# EasyEDA Pro project ProPrj_Practice 4 layer_2025-08-23.epro, schematic Schematic2
Board Name: 8 Digital Inputs; Create Date: 2025-08-18; Page Name: P1; Project Name: Practice 4 layer; Schematic Name: Schematic2; Update Date: 2025-08-18; Company: EasyEDA.com; Page Size: A4; Version: V1.0
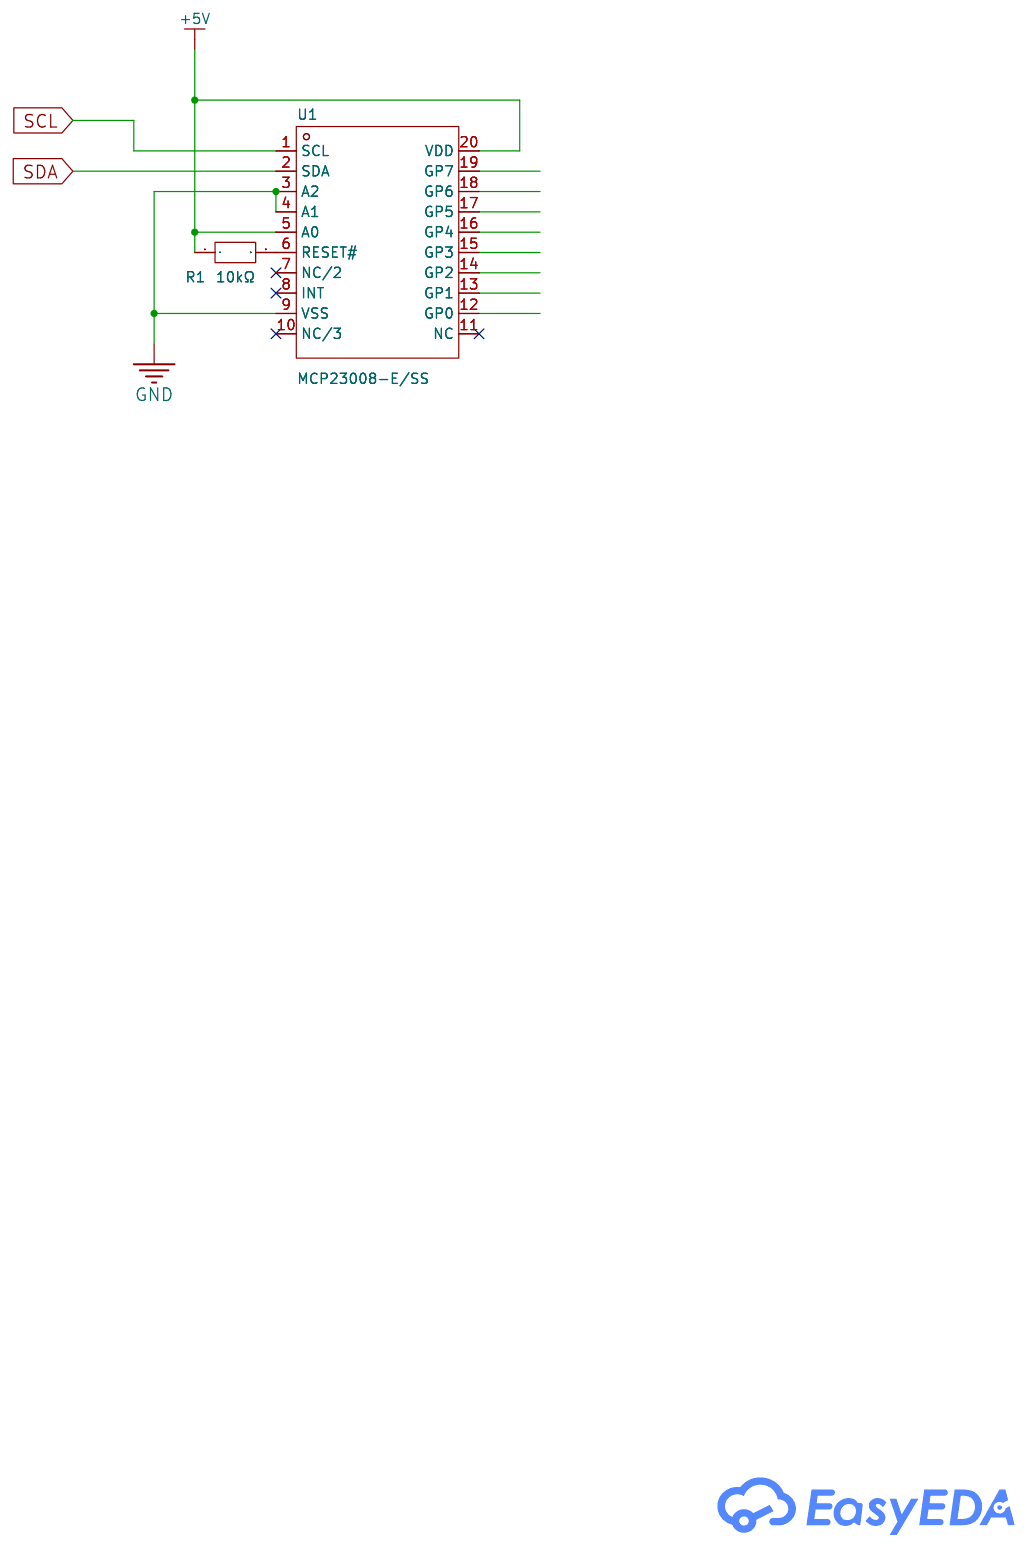
[diagram p7: schematic sheet]

## Parts
R1  10kΩ  [R0603]
U1  MCP23008-E/SS  [SSOP-20_L7.2-W5.3-P0.65-LS7.8-BL]

## Library data of the parts
R1 = FRC0603J103 TS: Type:Thick Film Resistors Resistance:10kΩ Tolerance:±5% Tolerance:±5% Power(Watts):0.1W Voltage-Supply(Max):75V Temperature Coefficient:±100ppm/℃ Temperature Coefficient:±100ppm/℃ Operating Temperature:-55℃~+155℃ Operating Temperature:-55℃~+155℃; LCSC Part Name: 10kΩ ±5% 100mW 厚膜电阻; Supplier Part: C2930027; Manufacturer: FOJAN(富捷); Supplier Footprint: 0603; JLCPCB Part Class: Extended Part; Datasheet: https://atta.szlcsc.com/upload/public/pdf/source/20211221/925EC7D7225764EE0046F22065062C87.pdf; Supplier: LCSC; Type: Thick Film Resistors; Tolerance: ±5%; Power(Watts): 0.1W; Voltage-Supply(Max): 75V; Temperature Coefficient: ±100ppm/℃; Operating Temperature: -55℃~+155℃
U1 = MCP23008-E/SS: Interface:I2C Number of I/O:8 Interrupt Output:With Interrupt Output Output Type: Supply Voltage:- Supply Voltage:- Output Source current:- Output Sink Current:- Clock Frequency:1.7MHz Operating Temperature:- Operating Temperature:-; LCSC Part Name: 8位I/O扩展器带串行接口; Supplier Part: C148011; Manufacturer: MICROCHIP(美国微芯); Supplier Footprint: SSOP-20-208mil; JLCPCB Part Class: Extended Part; Datasheet: https://atta.szlcsc.com/upload/public/pdf/source/20171228/C152205_15144475388971215001.pdf; Supplier: LCSC; Interface: I2C; Number of I/O: 8; Interrupt Output: With Interrupt Output; Clock Frequency: 1.7MHz

## Nets
+5V: R1.1 U1.5(A0) U1.20(VDD)
GND: U1.3(A2) U1.4(A1) U1.9(VSS)
CH1_DIGITAL-IN: U1.12(GP0)
CH2_DIGITAL-IN: U1.13(GP1)
CH3_DIGITAL-IN: U1.14(GP2)
CH4_DIGITAL-IN: U1.15(GP3)
CH5_DIGITAL-IN: U1.16(GP4)
CH6_DIGITAL-IN: U1.17(GP5)
CH7_DIGITAL-IN: U1.18(GP6)
CH8_DIGITAL-IN: U1.19(GP7)
SCL: U1.1(SCL)
SDA: U1.2(SDA)
Net-(R1-2): R1.2 U1.6(RESET#)

Not connected (* = marked no-connect by the designer): U1 7(NC/2)* 8(INT)* 10(NC/3)* 11(NC)*
